# EasyEDA schematic Prática-12.json
TITLE: Sheet_1; REV: 1.0; Date: 2020-11-18; Sheet: 1/1; Drawn By: mrrbcc; Company: Your Company
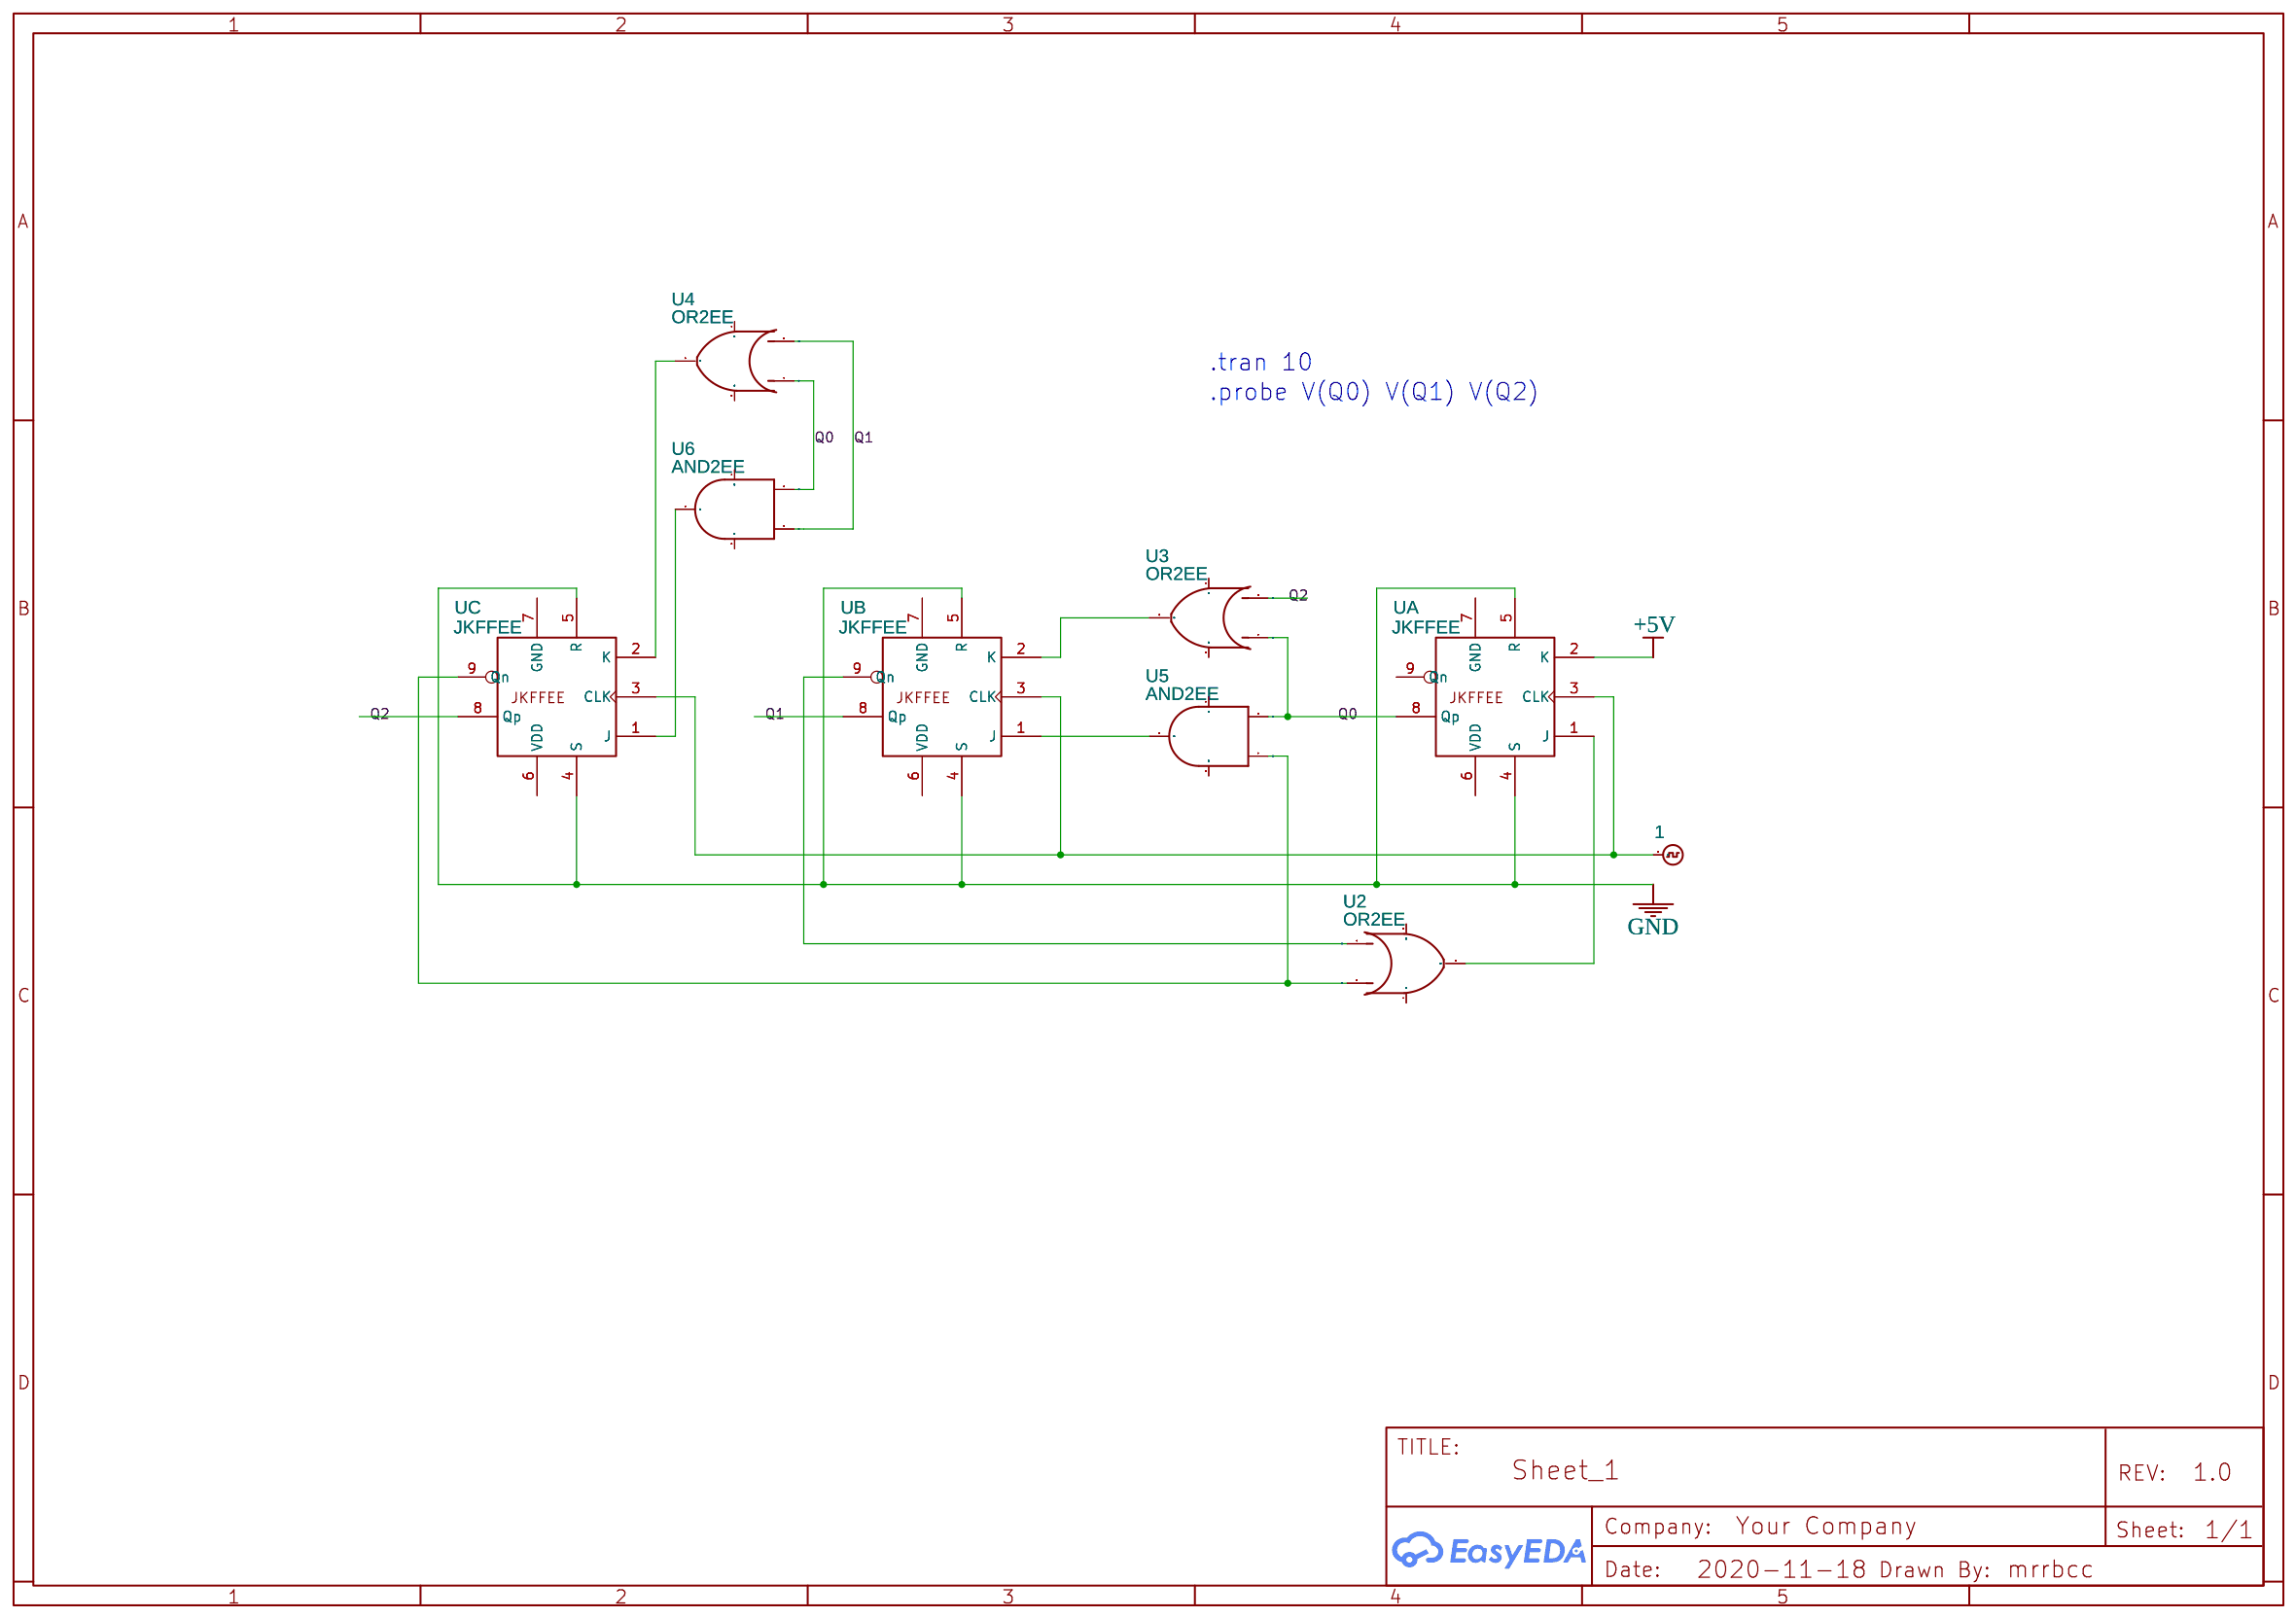
[diagram p0: schematic sheet]

## Parts
U1  1
U2  OR2EE
U3  OR2EE
U4  OR2EE
U5  AND2EE
U6  AND2EE
UA  JKFFEE
UB  JKFFEE
UC  JKFFEE

## Library data of the parts
U1 = DIGITALCLOCK: Contributor: EasyEDA; PreDisplay: 0
U2-U6 = LOGIC: Contributor: EasyEDA
UA UB UC = LOGIC: Contributor: EasyEDA; sourceId: 8C82kBTN5; Supplier: YUJING

## Nets
+5V: UA.2(K)
GND: UA.4(S) UA.5(R) UB.4(S) UB.5(R) UC.4(S) UC.5(R)
Q0: U3.1(INA) U4.1(INA) U5.2(INB) U6.2(INB) UA.8(Qp)
Q1: U4.2(INB) U6.1(INA) UB.8(Qp)
Q2: U3.2(INB) UC.8(Qp)
Net-(U1-1): U1.1 UA.3(CLK) UB.3(CLK) UC.3(CLK)
Net-(U2-1): U2.1(INA) UB.9(Qn)
Net-(U2-2): U2.2(INB) U5.1(INA) UC.9(Qn)
Net-(U2-5): U2.5(OUT) UA.1(J)
Net-(U3-5): U3.5(OUT) UB.2(K)
Net-(U4-5): U4.5(OUT) UC.2(K)
Net-(U5-5): U5.5(OUT) UB.1(J)
Net-(U6-5): U6.5(OUT) UC.1(J)

Not connected (* = marked no-connect by the designer): U2 3(VDD) 4(GND); U3 3(VDD) 4(GND); U4 3(VDD) 4(GND); U5 3(VDD) 4(GND); U6 3(VDD) 4(GND); UA 6(VDD) 7(GND) 9(Qn); UB 6(VDD) 7(GND); UC 6(VDD) 7(GND)

## Notes on the sheet
- .tran 10
- .probe V(Q0) V(Q1) V(Q2)
